# Altium schematic sheet Attenuator.SchDoc
size Letter; SheetNumber: 2
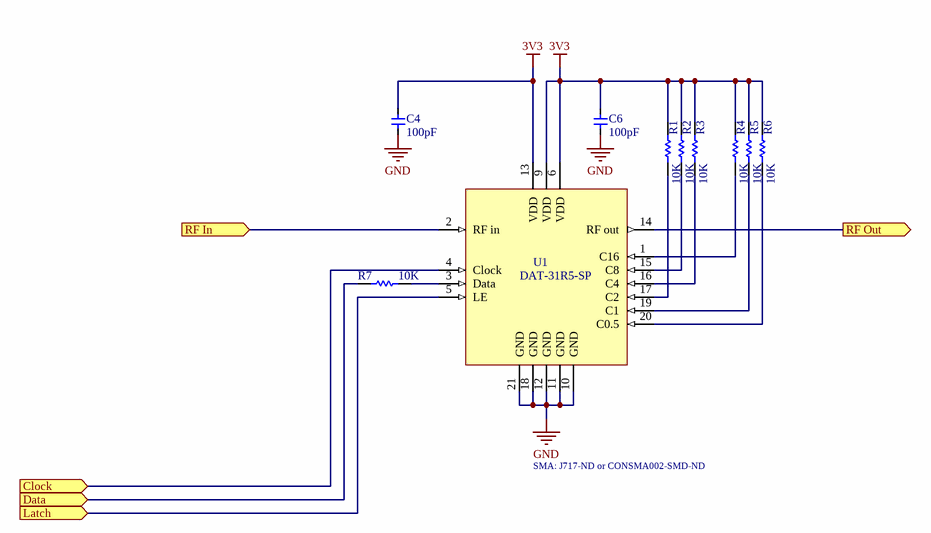
[diagram p0: Attenuator.SchDoc]

## Parts
C4  value 100pF  [0603C]  (hidden comment: SMT Cap)
C6  value 100pF  [0603C]  (hidden comment: SMT Cap)
R1  value 10K  [0603R]  (hidden comment: RES Semi)
R2  value 10K  [0603R]  (hidden comment: RES Semi)
R3  value 10K  [0603R]  (hidden comment: RES Semi)
R4  value 10K  [0603R]  (hidden comment: RES Semi)
R5  value 10K  [0603R]  (hidden comment: RES Semi)
R6  value 10K  [0603R]  (hidden comment: RES Semi)
R7  value 10K  [0603R]  (hidden comment: RES Semi)
U1  DAT-31R5-SP  [QFN50P400X400X90_HS-21N]

## Ports
Clock (in), Data (in), Latch (in), RF In (in), RF Out (out)

## Nets
3V3: C4.2 C6.2 R1.2 R2.2 R3.2 R4.2 R5.2 R6.2 U1.6(VDD) U1.9(VDD) U1.13(VDD)
GND: C4.1 C6.1 U1.10(GND) U1.11(GND) U1.12(GND) U1.18(GND) U1.21(GND)
Clock: U1.4(Clock) ; port Clock
Data: R7.2 ; port Data
Latch: U1.5(LE) ; port Latch
RF In: U1.2(RF_in) ; port RF In
RF Out: U1.14(RF_out) ; port RF Out
NetR1_1: R1.1 U1.17(C2)
NetR2_1: R2.1 U1.15(C8)
NetR3_1: R3.1 U1.16(C4)
NetR4_1: R4.1 U1.1(C16)
NetR5_1: R5.1 U1.19(C1)
NetR6_1: R6.1 U1.20(C0.5)
NetR7_1: R7.1 U1.3(Data)

Not connected (* = marked no-connect by the designer): U1 7(N/C) 8(N/C)

## Notes on the sheet
- SMA: J717-ND or CONSMA002-SMD-ND

## Library data of the parts
C4 C6 = Cap - SMT Small: Published: 8-Jun-2000; LatestRevisionDate: 29-May-2009; LatestRevisionNote: IPC-7351 Footprint Added.; PackageReference: C1206; Publisher: Altium Limited; PackageDescription: Chip Capacitor
R1-R7 = RES Semi: Semiconductor Resistor; Published: 8-Jun-2000; LatestRevisionDate: 17-Jul-2002; LatestRevisionNote: Re-released for DXP Platform.; PackageReference: AXIAL-0.5; Publisher: Altium Limited
U1 = DAT-31R5-SP: 31.5 dB, 0.5 dB Step 6 Bit, Serial Control Interface, Single Positive Supply Voltage